# EAGLE design USB-8452_flash_breakout (EAGLE 8.4.1)
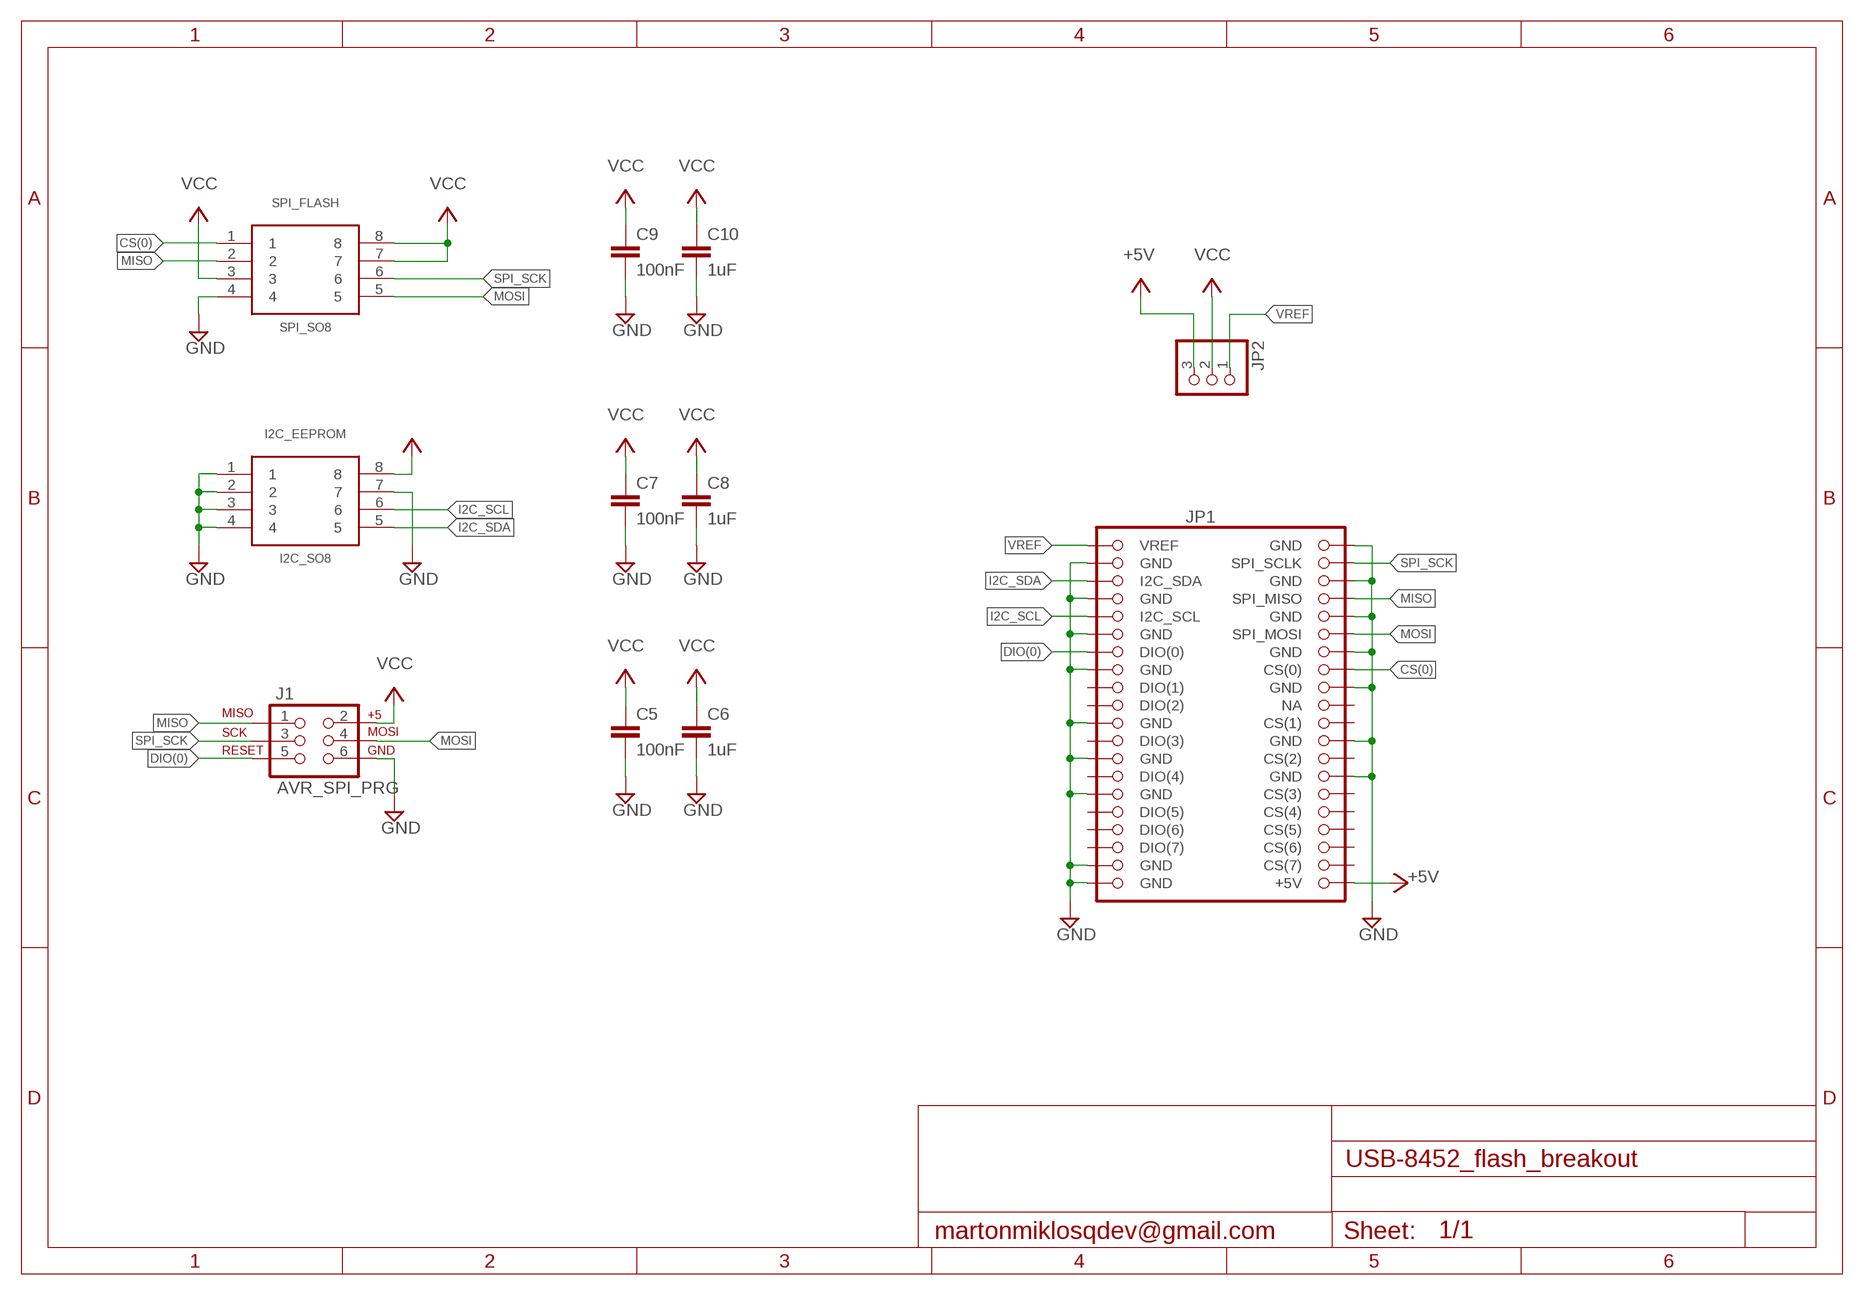
[diagram p0: schematic, sheet 1]

## Parts
C5  100nF  C-EUC0603  [C0603]
C6  1uF  C-EUC0603  [C0603]
C7  100nF  C-EUC0603  [C0603]
C8  1uF  C-EUC0603  [C0603]
C9  100nF  C-EUC0603  [C0603]
C10  1uF  C-EUC0603  [C0603]
I2C_EEPROM  I2C_SO8  SO8_LONG  [SO8_LONG]
J1  AVR_SPI_PRG  AVR_SPI_PRG_6NS  [2X3-NS]
JP1  USB8452_HEADER  [2X20]
JP2  PINHD-1X3  [1X03]
SPI_FLASH  SPI_SO8  SO8_LONG  [SO8_LONG]

## Nets
+5V: JP1.40(+5V) JP2.3
CS(0): JP1.16(CS(0)) SPI_FLASH.1
DIO(0): J1.5 JP1.13(DIO(0))
GND: C5.2 C6.2 C7.2 C8.2 C9.2 C10.2 I2C_EEPROM.1 I2C_EEPROM.2 I2C_EEPROM.3 I2C_EEPROM.4 I2C_EEPROM.7 J1.6 JP1.2(GND) JP1.3(GND) JP1.6(GND) JP1.7(GND) JP1.10(GND) JP1.11(GND) JP1.14(GND) JP1.15(GND) JP1.18(GND) JP1.21(GND) JP1.24(GND) JP1.25(GND) JP1.28(GND) JP1.29(GND) JP1.37(GND) JP1.39(GND) SPI_FLASH.4
I2C_SCL: I2C_EEPROM.6 JP1.9(I2C_SCL)
I2C_SDA: I2C_EEPROM.5 JP1.5(I2C_SDA)
MISO: J1.1 JP1.8(SPI_MISO) SPI_FLASH.2
MOSI: J1.4 JP1.12(SPI_MOSI) SPI_FLASH.5
SPI_SCK: J1.3 JP1.4(SPI_SCLK) SPI_FLASH.6
VCC: C5.1 C6.1 C7.1 C8.1 C9.1 C10.1 I2C_EEPROM.8 J1.2 JP2.2 SPI_FLASH.3 SPI_FLASH.7 SPI_FLASH.8
VREF: JP1.1(VREF) JP2.1
Unconnected: JP1.17(DIO(1)) JP1.19(DIO(2)) JP1.20(NA) JP1.22(CS(1)) JP1.23(DIO(3)) JP1.26(CS(2)) JP1.27(DIO(4)) JP1.30(CS(3)) JP1.31(DIO(5)) JP1.32(CS(4)) JP1.33(DIO(6)) JP1.34(CS(5)) JP1.35(DIO(7)) JP1.36(CS(6)) JP1.38(CS(7))

## Library data of the parts
C5-C10 = rcl:C-EU: CAPACITOR, European symbol
I2C_EEPROM SPI_FLASH = martonmiklos:SO8_LONG
J1 = SparkFun:AVR_SPI_PRG_6: AVR ISP 6 Pin This is the reduced ISP connector for AVR programming. Common on Arduino. This footprint will take up less PCB space and can be used with a 10-pin to 6-pin adapter such as SKU: BOB-08508
JP1 = martonmiklos:USB8452_HEADER: PIN HEADER
JP2 = pinhead:PINHD-1X3: PIN HEADER

## Board
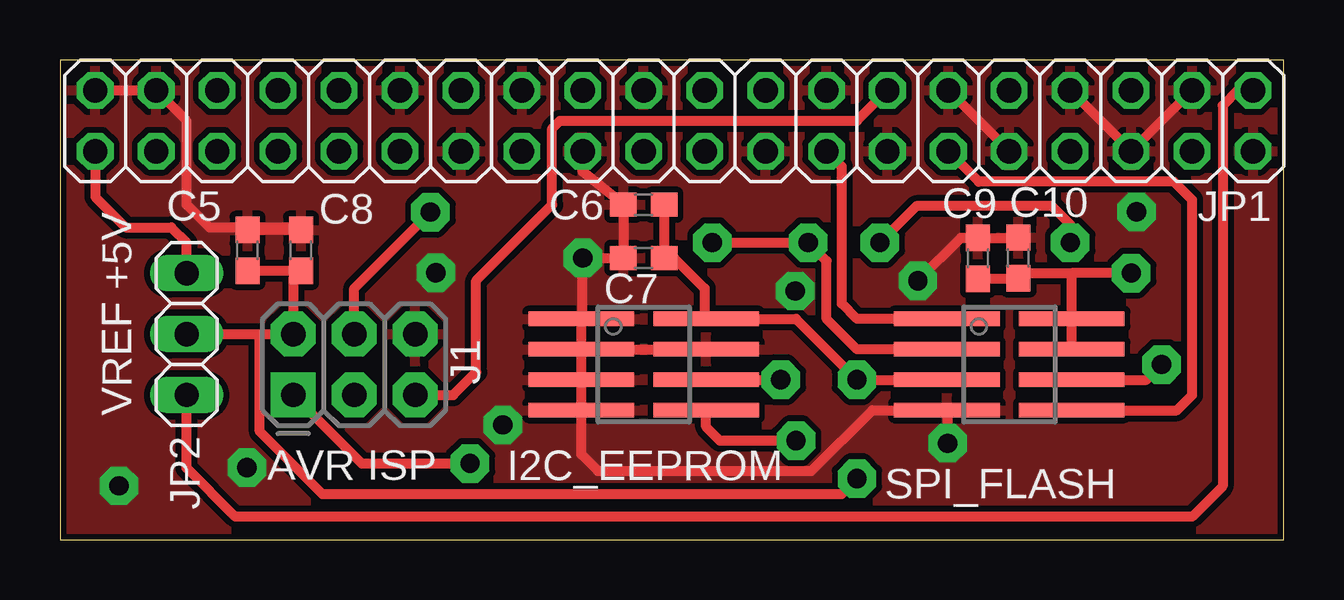
[diagram p1: board, top side]
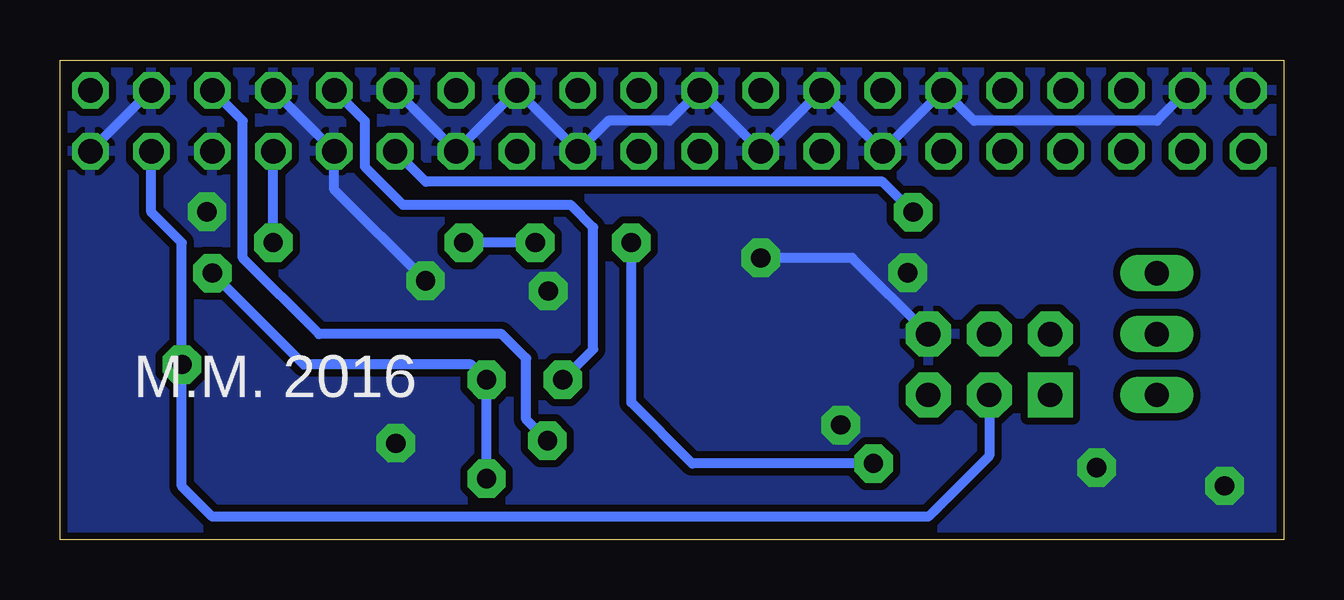
[diagram p2: board, bottom side, seen from below]

Size 51 x 20 mm. Coordinates in mm from the lower left corner, seen from the top.
Outline: 51,20 0,20 0,0 51,0 51,20
Copper layers (1*16): Top 0.035mm / dielectric 1.5mm / Bottom 0.035mm
Design rules "dirt_cheap_dirty_boards.v1": minimum track width 5mil, minimum drill 12mil, track to track 5mil, track to pad 5mil, pad to pad 5mil, via to via 5mil, smd to smd 0mil, copper to edge 10mil, drill to drill 10mil, minimum pad ring 10mil, minimum via ring 6mil, stop-mask expansion 2mil, vias tented up to drill 25mil, thermal gap 10mil

### Footprints (pad centres in the part's own frame; a part is rotated, then mirrored left to right if it is on the bottom)
C0603 = smd 1.1 x 1: 1 -0.85,0; 2 0.85,0
SO8_LONG = smd 4.4 x 0.6: 1 -2.6,1.905; 2 -2.6,0.635; 3 -2.6,-0.635; 4 -2.6,-1.905; 5 2.6,-1.905; 6 2.6,-0.635; 7 2.6,0.635; 8 2.6,1.905
2X3-NS = drill 1.016 pad 1.88 square: 1 -2.54,-1.27 | drill 1.016 pad 1.88 octagon: 2 -2.54,1.27; 3 0,-1.27; 4 0,1.27; 5 2.54,-1.27; 6 2.54,1.27
2X20 = drill 1.016 octagon: 1 -24.13,-1.27; 2 -24.13,1.27; 3 -21.59,-1.27; 4 -21.59,1.27; 5 -19.05,-1.27; 6 -19.05,1.27; 7 -16.51,-1.27; 8 -16.51,1.27; 9 -13.97,-1.27; 10 -13.97,1.27; 11 -11.43,-1.27; 12 -11.43,1.27; 13 -8.89,-1.27; 14 -8.89,1.27; 15 -6.35,-1.27; 16 -6.35,1.27; 17 -3.81,-1.27; 18 -3.81,1.27; 19 -1.27,-1.27; 20 -1.27,1.27; 21 1.27,-1.27; 22 1.27,1.27; 23 3.81,-1.27; 24 3.81,1.27; 25 6.35,-1.27; 26 6.35,1.27; 27 8.89,-1.27; 28 8.89,1.27; 29 11.43,-1.27; 30 11.43,1.27; 31 13.97,-1.27; 32 13.97,1.27; 33 16.51,-1.27; 34 16.51,1.27; 35 19.05,-1.27; 36 19.05,1.27; 37 21.59,-1.27; 38 21.59,1.27; 39 24.13,-1.27; 40 24.13,1.27
1X03 = drill 1.016 long: 1 -2.54,0; 2 0,0; 3 2.54,0

### Placement (x,y rotation side)
C5  7.82,12.06 90 top
C6  24.33,13.97 180 top
C7  24.33,11.74 180 top
C8  10.04,12.06 90 top
C9  39.95,11.74 90 top
C10  38.27,11.73 90 top
I2C_EEPROM  24.33,7.3 0 top
J1  12.27,7.3 0 top
JP1  25.6,17.46 180 top
JP2  5.28,8.57 90 top
SPI_FLASH  39.57,7.3 0 top

### Tracks (layer width: path | path; a pad name or v marks a point on that pad's centre or on a via)
+5V
  Top 0.406: JP1.40 1.47,14.29 2.74,13.01 4.64,13.01 5.28,12.38 JP2.3
CS(0)
  Top 0.406: SPI_FLASH.1 33.22,9.21 32.59,9.84 32.59,15.55 JP1.16
DIO(0)
  Top 0.406: JP1.13 33.22,17.46 20.84,17.46 20.52,17.14 20.52,13.97 17.35,10.79 17.35,6.98 16.39,6.03 J1.5
GND  (via drill 0.8 pad 1.6)
  Top 0.406: I2C_EEPROM.2 I2C_EEPROM.3 I2C_EEPROM.4 21.73,3.55 22.43,2.85 31.32,2.85 33.85,5.4 SPI_FLASH.4 | I2C_EEPROM.2 I2C_EEPROM.1 21.79,9.26 v21.79,11.74 C7.2 | C7.2 23.06,11.74 | C7.2 C6.2 21.79,15.34 JP1.24 | JP1.39 JP1.37 5.28,17.46 5.28,13.97 6.23,13.01 10.14,13.01 C8.2 C5.2 | I2C_EEPROM.2 I2C_EEPROM.7 | SPI_FLASH.4 37.03,5.33 | JP1.7 JP1.6 JP1.3 | JP1.11 JP1.10 | C9.2 39.93,12.58 C10.2 37.55,12.58 v35.76,10.79 | v37,4.02 37,5.37 SPI_FLASH.4
  Bottom 0.406: J1.6 17.98,11.74 v21.79,11.74 | JP1.37 5.28,17.46 12.9,17.46 JP1.29 JP1.28 JP1.25 JP1.24 JP1.21 25.6,17.46 28.14,17.46 JP1.18 JP1.15 JP1.14 JP1.11 | JP1.7 JP1.10 39.57,14.6 v35.76,10.79 | JP1.3 JP1.2
  other vias: 44.87,13.67 30.65,10.37 2.46,2.24 7.79,3 15.66,11.13 18.46,4.78
  pour Bottom (isolate 0.305): 51,0 0,0 0,20 51,20
  pour Top (isolate 0.254): 51,0 0,0 0,20 51,20
I2C_SCL  (via drill 0.8 pad 1.6)
  Top 0.406: I2C_EEPROM.6 v30.05,6.67
  Bottom 0.406: JP1.9 38.3,17.46 38.3,15.55 36.71,13.97 29.73,13.97 28.78,13.01 28.78,7.93 v30.05,6.67
I2C_SDA  (via drill 0.8 pad 1.6)
  Top 0.406: v30.68,4.12 27.51,4.12 26.93,4.7 I2C_EEPROM.5
  Bottom 0.406: v30.68,4.12 31.57,5.01 31.57,7.55 32.59,8.57 40.2,8.57 43.38,11.74 43.38,17.46 JP1.5
MISO  (via drill 0.8 pad 1.6)
  Top 0.406: SPI_FLASH.2 33.22,7.93 31.95,9.21 31.95,11.62 v31.19,12.38 v27.19,12.38 | J1.1 12.58,3.17 v17.09,3.17 | v42.11,12.38 42.11,13.14 41.35,13.9 35.7,13.9 v34.17,12.38
  Bottom 0.406: v42.11,12.38 JP1.8 | v31.19,12.38 v34.17,12.38 | v17.09,3.17 24.65,3.17 27.19,5.71 v27.19,12.38
MOSI  (via drill 0.8 pad 1.6)
  Top 0.406: SPI_FLASH.5 46.55,5.4 47.19,6.03 47.19,14.16 46.43,14.92 38.3,14.92 JP1.12 | J1.4 12.27,10.47 v15.44,13.65
  Bottom 0.406: v15.44,13.65 16.71,14.92 35.76,14.92 JP1.12
SPI_SCK  (via drill 0.8 pad 1.6)
  Top 0.406: SPI_FLASH.6 45.28,6.67 v45.92,7.3
  Bottom 0.406: JP1.4 47.19,13.65 45.92,12.38 v45.92,7.3 45.92,2.22 44.65,0.95 14.8,0.95 12.27,3.49 J1.3
VCC  (via drill 0.8 pad 1.6)
  Top 0.406: SPI_FLASH.8 SPI_FLASH.7 42.17,11.11 | SPI_FLASH.3 v33.22,6.67 30.68,9.21 I2C_EEPROM.8 26.87,9.26 26.87,10.47 25.6,11.74 C7.1 C6.1 | v33.22,2.54 32.59,1.9 10.93,1.9 8.33,4.51 8.33,8.57 | C5.1 C8.1 9.72,10.89 J1.2 8.33,8.57 | v44.65,11.11 42.17,11.11 | C10.1 38.28,10.89 C9.1 40.17,11.11 42.17,11.11 | JP2.2 8.33,8.57
  Bottom 0.406: v33.22,2.54 v33.22,6.67 33.85,7.3 40.84,7.3 v44.65,11.11
VREF
  Top 0.406: JP1.1 49.09,18.73 48.46,18.1 48.46,2.22 47.19,0.95 7.31,0.95 5.28,2.98 JP2.1

### Text on the board
tNames: VREF +5V | AVR ISP
bNames: M.M. 2016
_tNames: C5 | C6 | C9 | C10 | JP1 | C8 | C7 | J1 | JP2 | IC2 | IC6